# Altium schematic sheet barometer.SchDoc
size A4
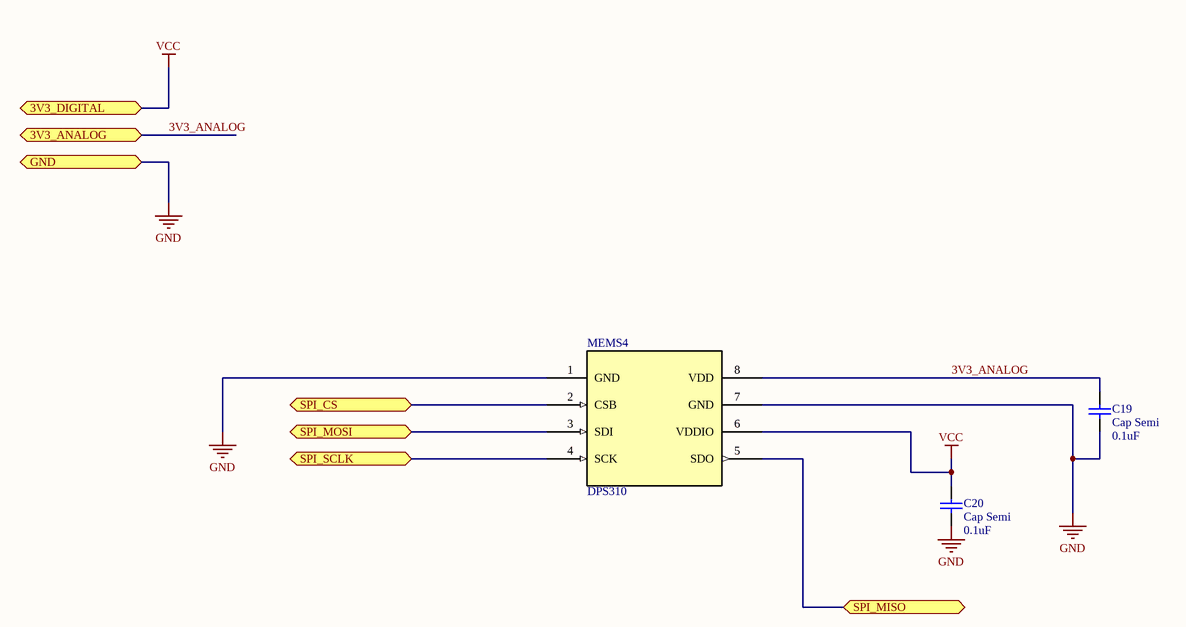
[diagram p0: barometer.SchDoc]

## Parts
C19  Cap Semi  value 0.1uF  [C1206]
C20  Cap Semi  value 0.1uF  [C1206]
MEMS4  DPS310  [PG-VLGA-8-1]

## Ports
3V3_ANALOG, 3V3_DIGITAL, GND, SPI_CS, SPI_MISO, SPI_MOSI, SPI_SCLK

## Nets
GND: C19.1 C20.1 MEMS4.1(GND) MEMS4.7(GND) ; port GND
VCC: C20.2 MEMS4.6(VDDIO) ; port 3V3_DIGITAL
3V3_ANALOG: C19.2 MEMS4.8(VDD) ; port 3V3_ANALOG
SPI_CS: MEMS4.2(CSB) ; port SPI_CS
SPI_MISO: MEMS4.5(SDO) ; port SPI_MISO
SPI_MOSI: MEMS4.3(SDI) ; port SPI_MOSI
SPI_SCLK: MEMS4.4(SCK) ; port SPI_SCLK

## Library data of the parts
C19 C20 = Cap Semi: Capacitor (Semiconductor SIM Model); Published: 8-Jun-2000; LatestRevisionDate: 29-May-2009; LatestRevisionNote: IPC-7351 Footprint Added.; PackageReference: C1206; Publisher: Altium Limited; PackageDescription: Chip Capacitor